# EAGLE design Rocky Switch Relay Shield (EAGLE 8.2.1)
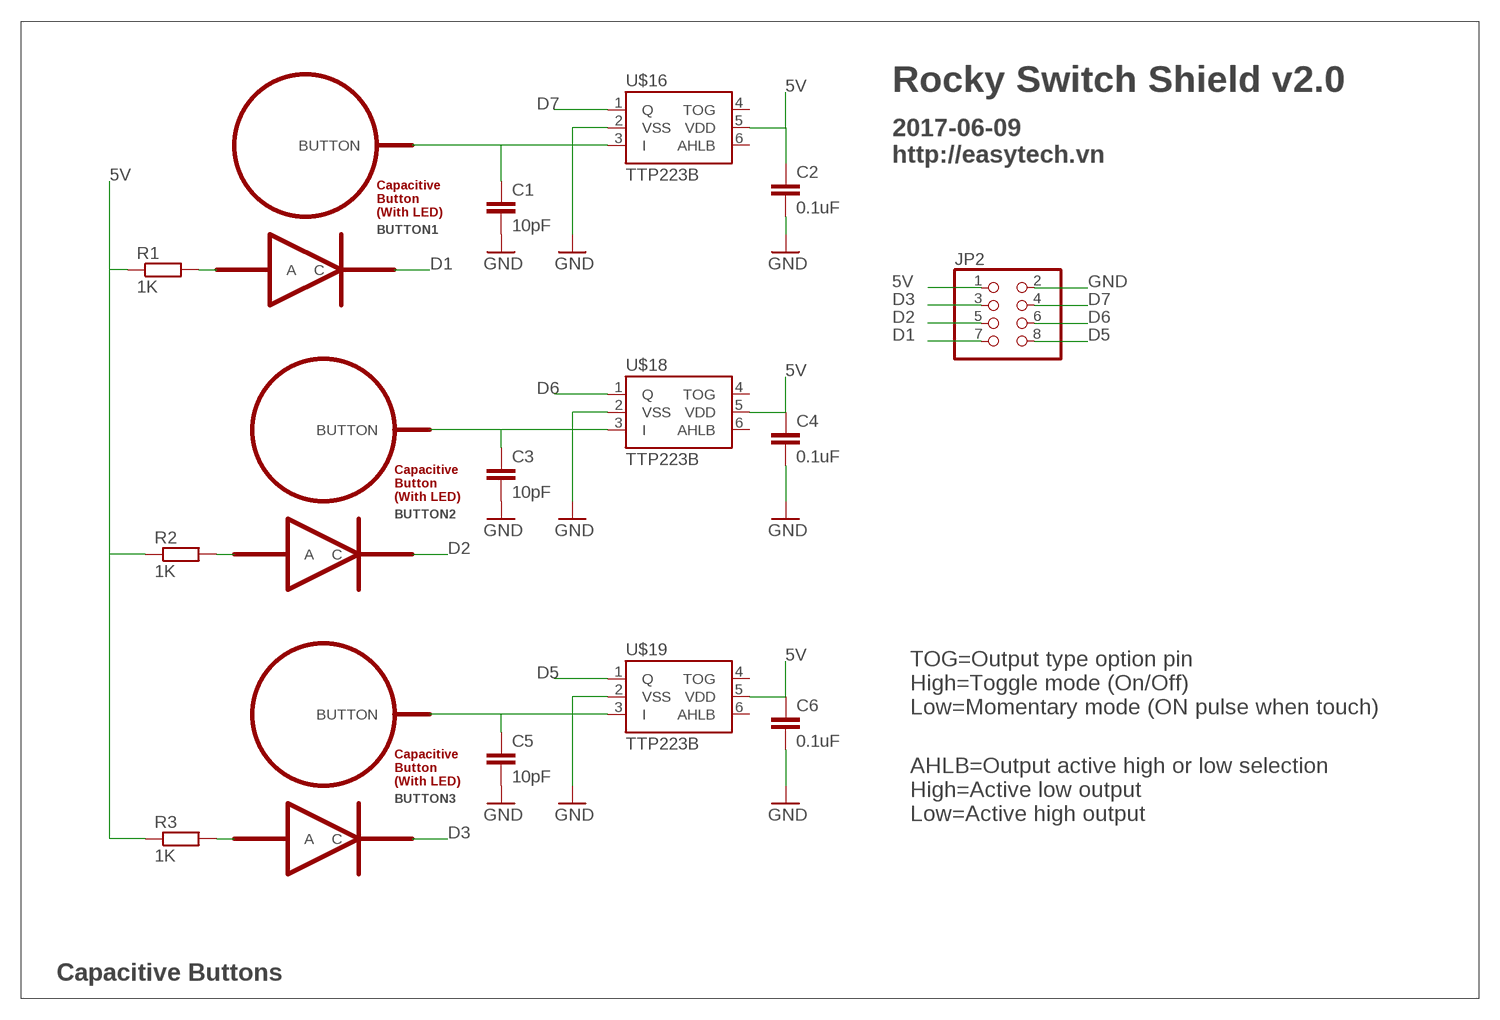
[diagram p0: schematic, sheet 1]

## Parts
BUTTON1  BUTTON_PASSIVE_LED  [BUTTON_PASSIVE_LED]
BUTTON2  BUTTON_PASSIVE_LED  [BUTTON_PASSIVE_LED]
BUTTON3  BUTTON_PASSIVE_LED  [BUTTON_PASSIVE_LED]
C1  10pF  C-EUC0805K  [C0805K]
C2  0.1uF  C-EUC0805K  [C0805K]
C3  10pF  C-EUC0805K  [C0805K]
C4  0.1uF  C-EUC0805K  [C0805K]
C5  10pF  C-EUC0805K  [C0805K]
C6  0.1uF  C-EUC0805K  [C0805K]
JP2  PINHD-2X4  [2X04]
R1  1K  R-EU_R0805  [R0805]
R2  1K  R-EU_R0805  [R0805]
R3  1K  R-EU_R0805  [R0805]
U$16  TTP223B  [SOT23-6]
U$18  TTP223B  [SOT23-6]
U$19  TTP223B  [SOT23-6]

## Nets
5V: C2.1 C4.1 C6.1 JP2.1 R1.1 R2.1 R3.1 U$16.5(VDD) U$18.5(VDD) U$19.5(VDD)
D1: BUTTON1.C JP2.7
D2: BUTTON2.C JP2.5
D3: BUTTON3.C JP2.3
D5: JP2.8 U$19.1(Q)
D6: JP2.6 U$18.1(Q)
D7: JP2.4 U$16.1(Q)
GND: C1.2 C2.2 C3.2 C4.2 C5.2 C6.2 JP2.2 U$16.2(VSS) U$18.2(VSS) U$19.2(VSS)
I1: BUTTON1.BUTTON C1.1 U$16.3(I)
I2: BUTTON2.BUTTON C3.1 U$18.3(I)
I3: BUTTON3.BUTTON C5.1 U$19.3(I)
N$10: BUTTON1.A R1.2
N$15: BUTTON2.A R2.2
N$16: BUTTON3.A R3.2
Unconnected: U$16.4(TOG) U$16.6(AHLB) U$18.4(TOG) U$18.6(AHLB) U$19.4(TOG) U$19.6(AHLB)

## Notes on the sheet
- Rocky Switch Shield v2.0
- 2017-06-09
  http://easytech.vn
- TOG=Output type option pin
  High=Toggle mode (On/Off)
  Low=Momentary mode (ON pulse when touch)
- AHLB=Output active high or low selection
  High=Active low output
  Low=Active high output
- Capacitive Buttons

## Library data of the parts
BUTTON1-BUTTON3 = My Eagle Lib:BUTTON_PASSIVE_LED
C1-C6 = rcl:C-EU: CAPACITOR, European symbol
JP2 = pinhead:PINHD-2X4: PIN HEADER
R1-R3 = rcl:R-EU_: RESISTOR, European symbol
U$16 U$18 U$19 = My Eagle Lib:TTP223B

## Board
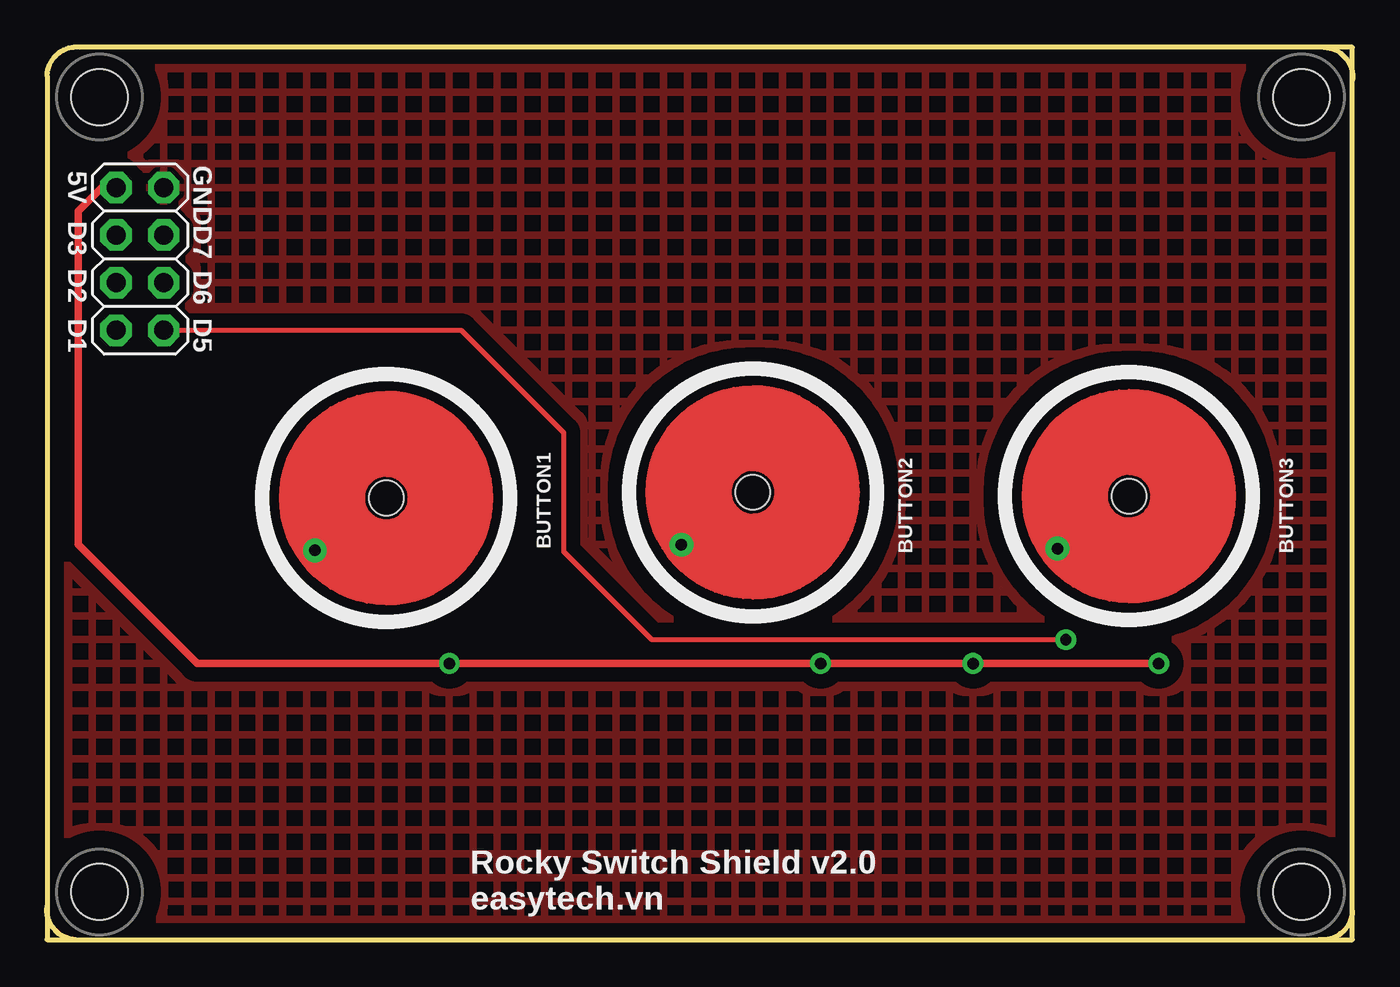
[diagram p1: board, top side]
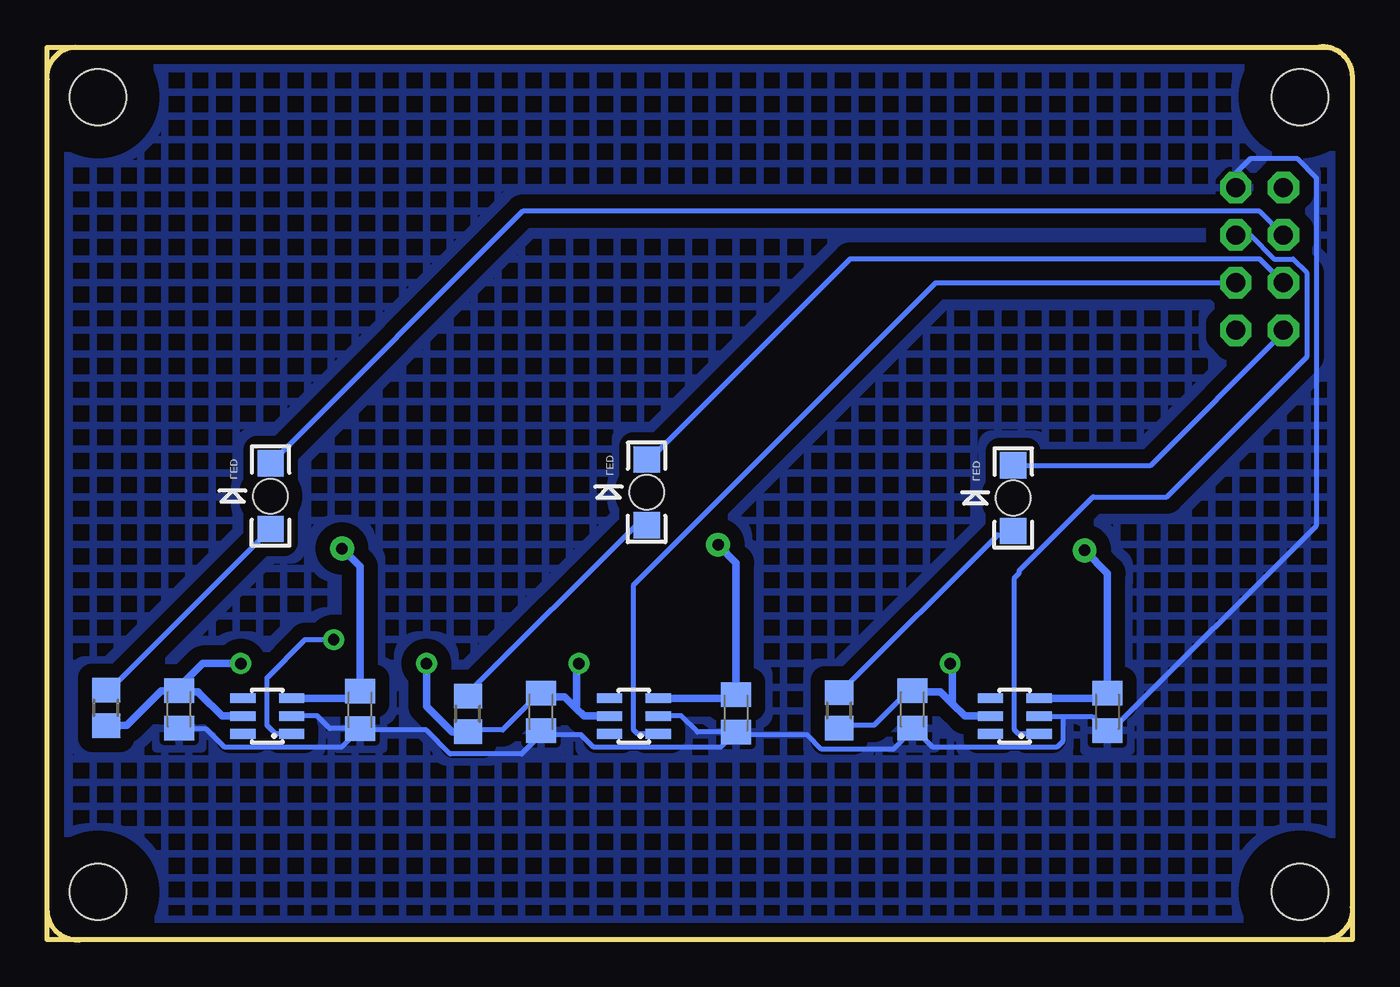
[diagram p2: board, bottom side, seen from below]

Size 69.67 x 47.65 mm. Coordinates in mm from the lower left corner, seen from the top.
Outline: 1.53,0.01 0.01,0.01 0.01,1.79
Outline: 1.53,0.01 67.88,0.01
Outline: 67.88,0.01 69.66,0.01 69.66,47.63 1.41,47.63
Outline: 0.01,1.79 0.01,46.11 arc-95 1.79,47.64
Outline: 68.13,47.62 arc-95 69.66,45.86
Outline: 69.66,1.53 arc-95 67.88,0.01
Outline: 1.53,0.01 arc-95 0.01,1.79
Copper layers (1*16): Top 0.035mm / dielectric 1.5mm / Bottom 0.035mm
Design rules "default *": minimum track width 10mil, minimum drill 24mil, track to track 10mil, track to pad 10mil, pad to pad 10mil, via to via 10mil, smd to smd 8mil, copper to edge 20mil, drill to drill 12mil, minimum pad ring 13mil, minimum via ring 10mil, stop-mask expansion 4mil, vias tented up to drill 0mil, thermal gap 10mil

### Footprints (pad centres in the part's own frame; a part is rotated, then mirrored left to right if it is on the bottom)
BUTTON_PASSIVE_LED = smd 1.397 x 1.4 bottom: A -1.753,0; C 1.754,0 | drill 0.61: BUTTON -2.794,3.81 | hole 1.854: 0,0
C0805K = smd 1.3 x 1.6: 1 -1,0; 2 1,0
2X04 = drill 1.016 octagon: 1 -3.81,-1.27; 2 -3.81,1.27; 3 -1.27,-1.27; 4 -1.27,1.27; 5 1.27,-1.27; 6 1.27,1.27; 7 3.81,-1.27; 8 3.81,1.27
R0805 = smd 1.3 x 1.5: 1 -0.95,0; 2 0.95,0
KFH-M3 = hole 3: 0,0
SOT23-6 = smd 0.508 x 1.346: 1 0.95,1.3; 2 0,1.3; 3 -0.95,1.3; 4 -0.95,-1.3; 5 0,-1.3; 6 0.95,-1.3

### Placement (x,y rotation side)
BUTTON1  18.11,23.57 90 top
BUTTON2  37.67,23.87 90 top
BUTTON3  57.73,23.67 90 top
C1  13.08,12.16 270 bottom
C2  23.49,12.29 270 bottom
C3  32.89,12.09 270 bottom
C4  43.3,12.16 270 bottom
C5  52.96,12.27 270 bottom
C6  62.61,12.29 270 bottom
JP2  4.96,36.33 270 top
R1  27.39,12.24 90 bottom
R2  47.2,12.05 90 bottom
R3  66.51,12.37 90 bottom
U$6  [KFH-M3]  2.8,2.55 0 top
U$7  [KFH-M3]  66.94,2.55 0 top
U$8  [KFH-M3]  66.94,44.97 0 top
U$9  [KFH-M3]  2.8,44.97 0 top
U$16  18.03,11.94 270 bottom
U$18  38.35,11.94 270 bottom
U$19  57.91,11.94 270 bottom

### Tracks (layer width: path | path; a pad name or v marks a point on that pad's centre or on a via)
5V  (via drill 0.61)
  Top 0.406: JP2.1 2.93,40.14 1.66,38.87 1.66,21.09 8.01,14.74 v21.47,14.74 v41.29,14.74 v59.32,14.74
  Bottom 0.254: 61.48,13.15 61.51,13.12 | 66.43,11.44 R3.1 | 62.62,13.47 C6.1 | C4.1 43.32,13.22 45.35,11.19 47.13,11.19 R2.1 47.38,11.19 | R1.1 27.32,11.44 25.54,11.44 23.51,13.47 C2.1
  Bottom 0.406: U$19.5 60.32,11.94 61.51,13.12 61.61,13.22 62.54,13.22 C6.1 63.56,13.29 65.42,11.44 66.43,11.44 | v59.32,14.74 61.35,14.74 62.62,13.47 | R2.1 48.06,11.1 49.41,12.46 v49.41,14.74 | U$18.5 41.02,11.94 41.41,12.33 | 41.41,12.33 42.05,12.96 43.1,12.96 C4.1 | 41.41,12.33 41.41,14.62 v41.29,14.74 | U$16.5 20.7,11.94 21.35,12.58 | 21.35,12.58 21.98,13.22 23.42,13.22 C2.1 | 21.35,12.58 21.35,14.62 21.22,14.74 v21.47,14.74
D1
  Bottom 0.254: 17.92,25.41 BUTTON1.C 18.07,25.28 10.81,25.28 3.69,32.4 JP2.7
D2
  Bottom 0.254: 20.71,36.33 4.96,36.33 JP2.5 | 20.71,36.33 20.97,36.33 | BUTTON2.C 37.48,25.66 26.81,36.33 20.71,36.33
D3
  Bottom 0.254: JP2.3 4.96,38.87 44.28,38.87 BUTTON3.C 57.54,25.66
D5  (via drill 0.61)
  Top 0.254: v54.37,16.01 32.27,16.01 27.57,20.71 27.57,27.06 22.11,32.52 19.44,32.52 | JP2.8 19.44,32.52 | 19.44,32.52 19.7,32.52
  Bottom 0.254: U$19.1 57.47,10.99 57.92,11.44 57.92,13.98 55.89,16.01 v54.37,16.01
D6
  Bottom 0.254: U$18.1 38.16,10.99 38.36,11.19 38.36,18.93 22.24,35.06 JP2.6
D7
  Bottom 0.254: JP2.4 5.47,37.6 4.2,36.33 3.19,36.33 2.42,35.57 2.42,31.13 9.92,23.63 13.85,23.63 17.79,19.7 17.79,19.57 18.04,19.31 18.04,11.19 17.84,10.99 U$16.1
GND
  Bottom 0.254: U$19.2 56.4,11.88 56.34,11.95 55.26,11.95 54.57,11.27 C5.2 | C5.2 53.22,11.57 | C6.2 62.43,11.25 61.16,11.25 60.21,10.3 53.93,10.3 C5.2 | 15.44,11.88 13.85,11.88 13.22,11.25 C1.2 12.84,11.19 1.92,22.11 1.92,40.65 2.93,41.67 5.47,41.67 6.23,40.9 JP2.2 | 15.44,11.88 16.71,11.88 U$16.2 | U$18.2 37.03,11.88 36.97,11.95 35.82,11.95 34.96,11.09 C3.2 | C3.2 32.9,11.25 | 15.44,11.88 15.44,10.61 15.76,10.3 22.43,10.3 23.38,11.25 C2.2 23.51,11.19 24.52,10.17 28.33,10.17 29.09,10.93 32.65,10.93 C3.2 | C5.2 52.72,11.19 49.41,11.19 48.14,9.92 44.33,9.92 43.32,10.93 C4.2 43.06,10.93 41.16,10.93 40.52,10.3 33.68,10.3 C3.2
  pour Bottom (isolate 0.762, hatched): 82.55,55.76 -9.13,55 -9.13,-4.69 82.55,-3.93
  pour Top (isolate 0.762, hatched): 82.75,55.64 -9.51,55.26 -9.51,-4.43 82.75,-4.05
I1
  Bottom 0.406: U$16.3 13.36,12.89 C1.1 13.08,19.56 BUTTON1.BUTTON
I2
  Bottom 0.406: U$18.3 33.09,12.89 C3.1 32.89,20.11 BUTTON2.BUTTON
I3
  Bottom 0.406: U$19.3 53.34,12.89 C5.1 52.96,19.91 BUTTON3.BUTTON
N$10
  Bottom 0.254: BUTTON1.A 18.17,21.6 18.93,21.6 27.32,13.22 R1.2
N$15
  Bottom 0.254: BUTTON2.A 37.73,22.11 38.24,22.11 47.13,13.22 R2.2
N$16
  Bottom 0.254: 57.67,22.04 BUTTON3.A 66.43,13.22 R3.2

### Text on the board
tNames: GND | 5V | D3 | D7 | D2 | D6 | D1 | D5 | Rocky Switch Shield v2.0 / easytech.vn